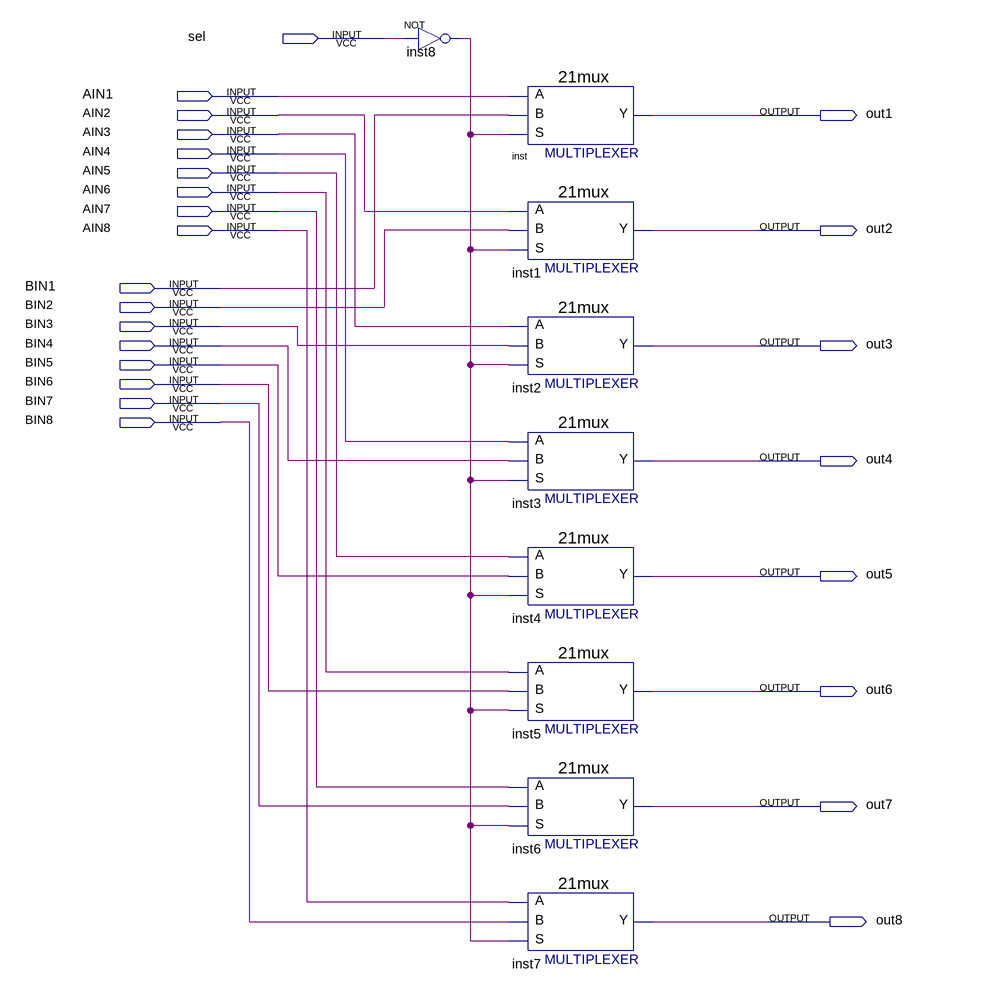
[diagram p0: schematic sheet]
// Quartus schematic MUX8.bdf as structural Verilog: 9 symbols, 25 pins
module MUX8 (
  input  sel,
  input  AIN1,
  input  AIN2,
  input  AIN3,
  input  AIN4,
  input  AIN5,
  input  AIN6,
  input  AIN7,
  input  AIN8,
  input  BIN1,
  input  BIN2,
  input  BIN3,
  input  BIN4,
  input  BIN5,
  input  BIN6,
  input  BIN7,
  input  BIN8,
  output out1,
  output out2,
  output out3,
  output out4,
  output out5,
  output out6,
  output out7,
  output out8
);

  wire inst8_out;

  not inst8 (inst8_out, sel);
  \21mux  inst (.S(inst8_out), .B(BIN1), .A(AIN1), .Y(out1));
  \21mux  inst1 (.S(inst8_out), .B(BIN2), .A(AIN2), .Y(out2));
  \21mux  inst2 (.S(inst8_out), .B(BIN3), .A(AIN3), .Y(out3));
  \21mux  inst3 (.S(inst8_out), .B(BIN4), .A(AIN4), .Y(out4));
  \21mux  inst4 (.S(inst8_out), .B(BIN5), .A(AIN5), .Y(out5));
  \21mux  inst5 (.S(inst8_out), .B(BIN6), .A(AIN6), .Y(out6));
  \21mux  inst6 (.S(inst8_out), .B(BIN7), .A(AIN7), .Y(out7));
  \21mux  inst7 (.S(inst8_out), .B(BIN8), .A(AIN8), .Y(out8));
endmodule
